# Altium project TestBoard_02.PrjPcb
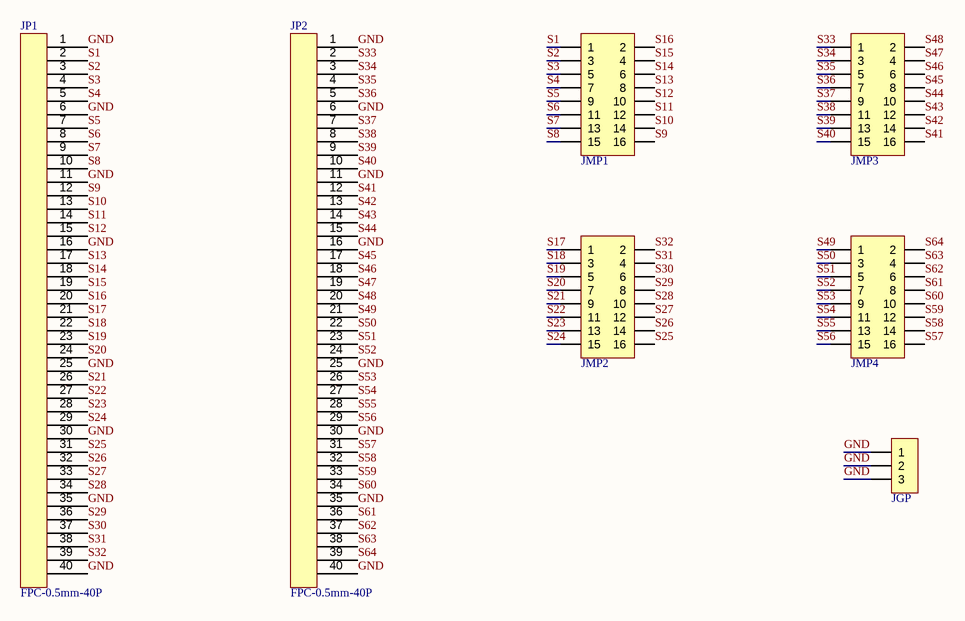
[diagram p0: TestBoard.SchDoc]
Version: 1.1 (TO); RepoURL: https://github.com/hkust-fiona/fiona-hardware.git; Project: FIONA Toolchain (Test Board #02); License: Light the Way Forward; Author: Yinyi (Shannon) LIU
1 sheet, 7 parts. Net scope: global (net labels, ports and power ports of the same name join across sheets).
Board file: PCB_TestBoard.PcbDoc

## Sheet TestBoard.SchDoc: Interfacing / Test Board (FPC-40 to HDR-2x8)
size A4; Date: July 2023; Author: Shannon; SheetNumber: 1; SheetTotal: 1

### Parts
JGP  HDR-1X3  [XH2.54-LI-3P]  (value not drawn)
JMP1  Header 8X2  [IDC2.54-LI-2x8P]  (value not drawn)
JMP2  Header 8X2  [IDC2.54-LI-2x8P]  (value not drawn)
JMP3  Header 8X2  [IDC2.54-LI-2x8P]  (value not drawn)
JMP4  Header 8X2  [IDC2.54-LI-2x8P]  (value not drawn)
JP1  FPC-0.5mm-40P  [FPC0.5 2H-WS-40P]
JP2  FPC-0.5mm-40P  [FPC0.5 2H-WS-40P]

### Nets
GND: JGP.1 JGP.2 JGP.3 JP1.1 JP1.6 JP1.11 JP1.16 JP1.25 JP1.30 JP1.35 JP1.40 JP2.1 JP2.6 JP2.11 JP2.16 JP2.25 JP2.30 JP2.35 JP2.40
S1: JMP1.1 JP1.2
S2: JMP1.3 JP1.3
S3: JMP1.5 JP1.4
S4: JMP1.7 JP1.5
S5: JMP1.9 JP1.7
S6: JMP1.11 JP1.8
S7: JMP1.13 JP1.9
S8: JMP1.15 JP1.10
S9: JMP1.16 JP1.12
S10: JMP1.14 JP1.13
S11: JMP1.12 JP1.14
S12: JMP1.10 JP1.15
S13: JMP1.8 JP1.17
S14: JMP1.6 JP1.18
S15: JMP1.4 JP1.19
S16: JMP1.2 JP1.20
S17: JMP2.1 JP1.21
S18: JMP2.3 JP1.22
S19: JMP2.5 JP1.23
S20: JMP2.7 JP1.24
S21: JMP2.9 JP1.26
S22: JMP2.11 JP1.27
S23: JMP2.13 JP1.28
S24: JMP2.15 JP1.29
S25: JMP2.16 JP1.31
S26: JMP2.14 JP1.32
S27: JMP2.12 JP1.33
S28: JMP2.10 JP1.34
S29: JMP2.8 JP1.36
S30: JMP2.6 JP1.37
S31: JMP2.4 JP1.38
S32: JMP2.2 JP1.39
S33: JMP3.1 JP2.2
S34: JMP3.3 JP2.3
S35: JMP3.5 JP2.4
S36: JMP3.7 JP2.5
S37: JMP3.9 JP2.7
S38: JMP3.11 JP2.8
S39: JMP3.13 JP2.9
S40: JMP3.15 JP2.10
S41: JMP3.16 JP2.12
S42: JMP3.14 JP2.13
S43: JMP3.12 JP2.14
S44: JMP3.10 JP2.15
S45: JMP3.8 JP2.17
S46: JMP3.6 JP2.18
S47: JMP3.4 JP2.19
S48: JMP3.2 JP2.20
S49: JMP4.1 JP2.21
S50: JMP4.3 JP2.22
S51: JMP4.5 JP2.23
S52: JMP4.7 JP2.24
S53: JMP4.9 JP2.26
S54: JMP4.11 JP2.27
S55: JMP4.13 JP2.28
S56: JMP4.15 JP2.29
S57: JMP4.16 JP2.31
S58: JMP4.14 JP2.32
S59: JMP4.12 JP2.33
S60: JMP4.10 JP2.34
S61: JMP4.8 JP2.36
S62: JMP4.6 JP2.37
S63: JMP4.4 JP2.38
S64: JMP4.2 JP2.39

### Notes on the sheet
- Title
- FileName:
- Version:
- Date:
- Project
- Designed By:
- Descriptions:
- Sheet:
- of

### Library data of the parts
JGP = Header 3: 3P接插件; 版权归属: 封装库来自淘宝 ID：黄晶宝石; BOM名称: 3P接插件; 学习资源: https://shop463601444.taobao.com
JMP1-JMP4 = Header 8X2: 8*2P接插件; 版权归属: 封装库来自淘宝 ID：黄晶宝石; BOM名称: 8*2P接插件; 学习资源: https://shop463601444.taobao.com
JP1 JP2 = FPC-0.5mm-40P: FPC Connector 0.5mm 40PIN